# EAGLE design ACME_V4.2 (EAGLE 9.2.1)
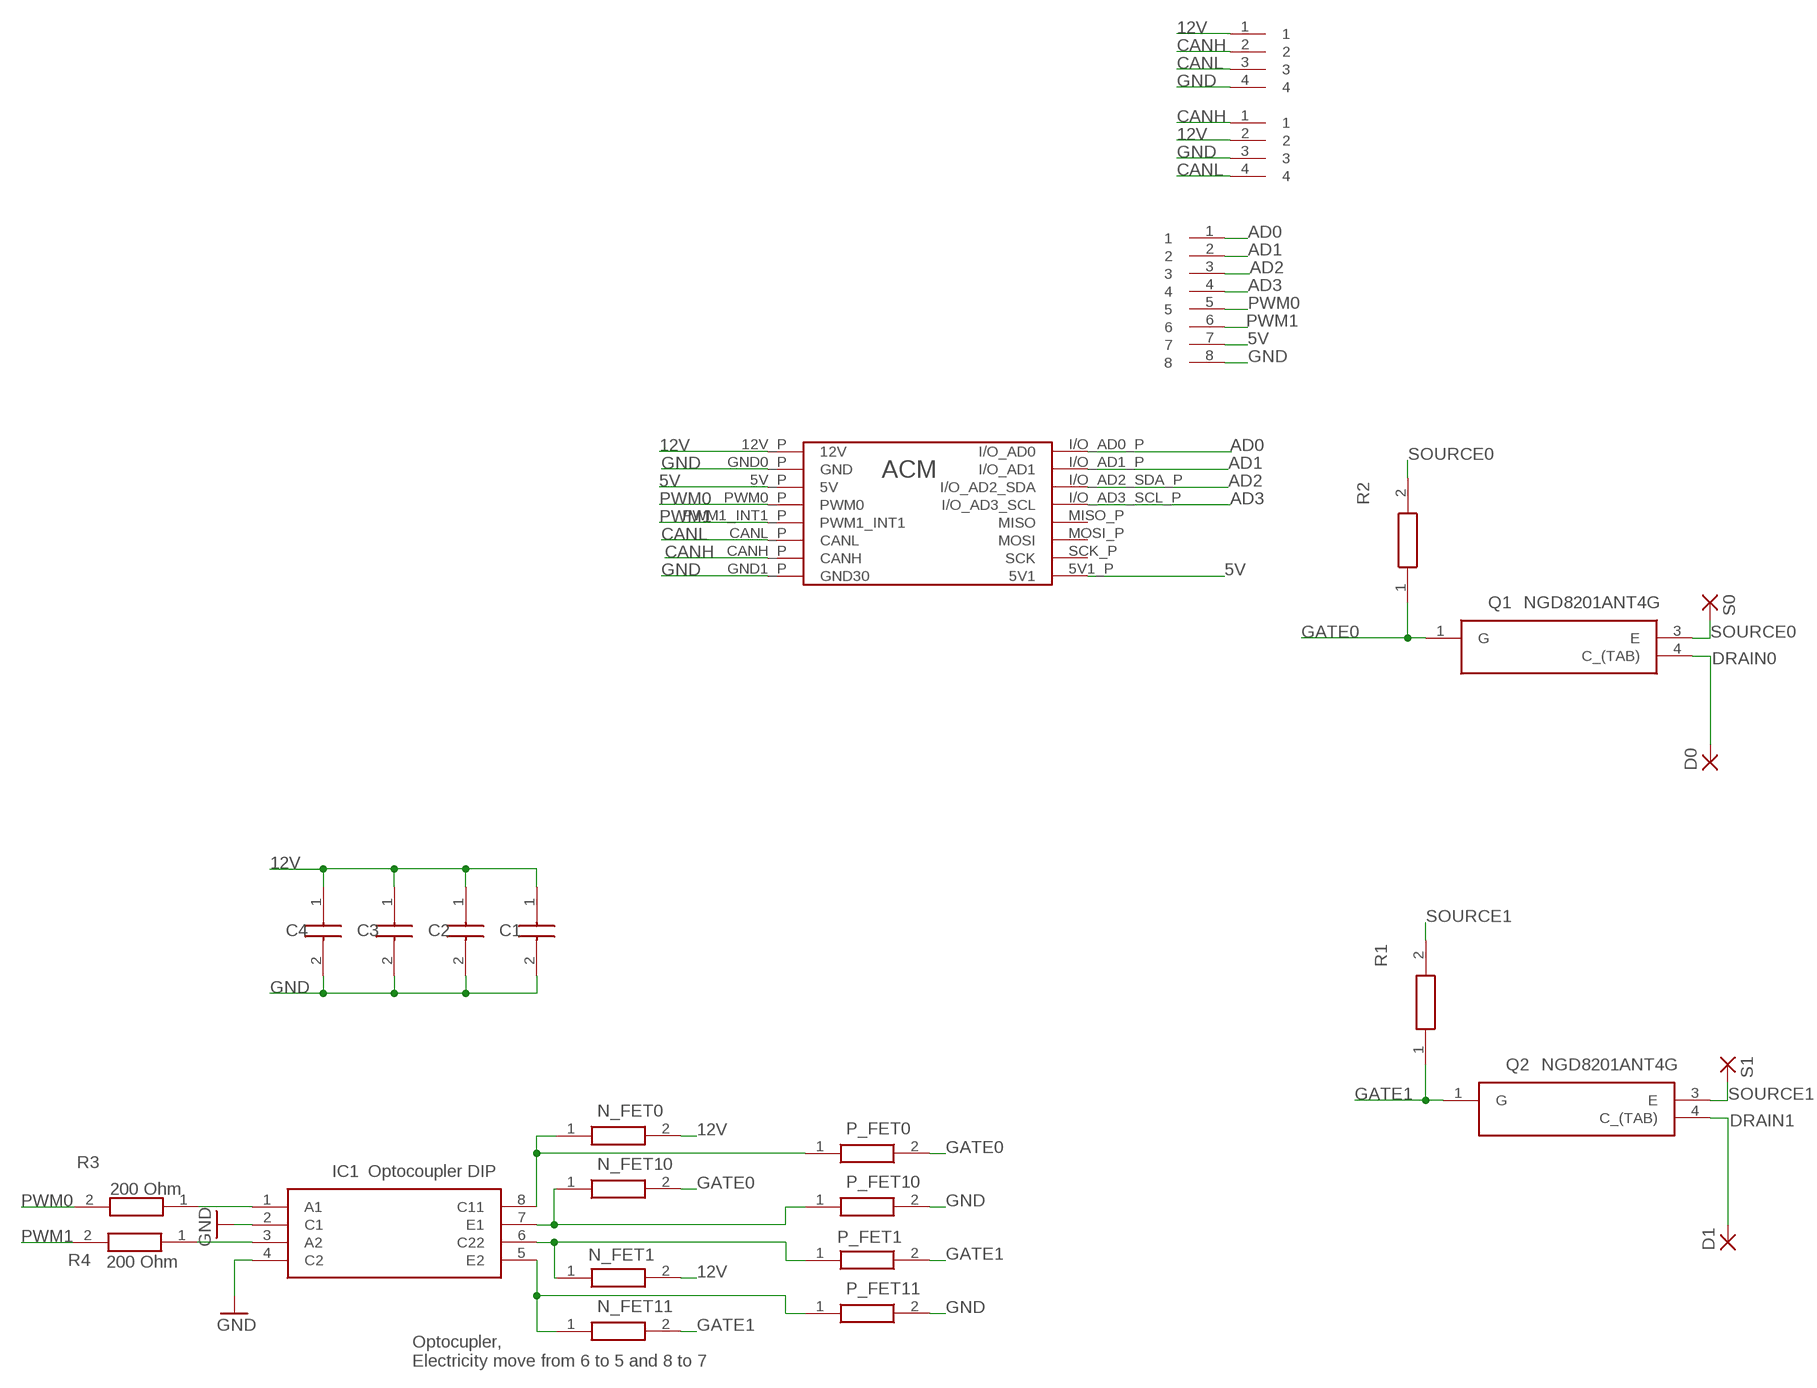
[diagram p0: schematic, sheet 1]

## Parts
C1  TACL105K006XTA  [CAPPC1709X100N]
C2  TACL105K006XTA  [CAPPC1709X100N]
C3  TACL105K006XTA  [CAPPC1709X100N]
C4  TACL105K006XTA  [CAPPC1709X100N]
D0  WIREPADSMD5-2,5  [5-2,5]
D1  WIREPADSMD5-2,5  [5-2,5]
IC1  Optocoupler DIP  TLP350(F)  [DIP762W60P254L966H485Q8N]
N_FET0  ERA-3AEB2262V  [RESC1608X55N]
N_FET1  ERA-3AEB2262V  [RESC1608X55N]
N_FET10  ERA-3AEB2262V  [RESC1608X55N]
N_FET11  ERA-3AEB2262V  [RESC1608X55N]
P_FET0  ERA-3AEB2262V  [RESC1608X55N]
P_FET1  ERA-3AEB2262V  [RESC1608X55N]
P_FET10  ERA-3AEB2262V  [RESC1608X55N]
P_FET11  ERA-3AEB2262V  [RESC1608X55N]
Q1  NGD8201ANT4G  [TO229P990X238-4N]
Q2  NGD8201ANT4G  [TO229P990X238-4N]
R1  ERA-3AEB2262V  [RESC1608X55N]
R2  ERA-3AEB2262V  [RESC1608X55N]
R3  200 Ohm  ERA-3AEB2262V  [RESC1608X55N]
R4  200 Ohm  ERA-3AEB2262V  [RESC1608X55N]
S0  WIREPADSMD5-2,5  [5-2,5]
S1  WIREPADSMD5-2,5  [5-2,5]
U$1  ACM_CASTELLATED  [ACM_CAS_FP]
U$3  16P_CONNECTOR  [16P_CONNECTOR_FP]
U$4  16P_CONNECTOR  [16P_CONNECTOR_FP]
U$5  16P_CONNECTOR  [16P_CONNECTOR_FP]

## Nets
5V: U$1.5V1_P(5V1) U$1.5V_P(5V) U$5.7
12V: C1.1(+) C2.1(+) C3.1(+) C4.1(+) N_FET0.2 N_FET1.2 U$1.12V_P(12V) U$3.1 U$4.2
AD0: U$1.I/O_AD0_P(I/O_AD0) U$5.1
AD1: U$1.I/O_AD1_P(I/O_AD1) U$5.2
AD2: U$1.I/O_AD2_SDA_P(I/O_AD2_SDA) U$5.3
AD3: U$1.I/O_AD3_SCL_P(I/O_AD3_SCL) U$5.4
CANH: U$1.CANH_P(CANH) U$3.2 U$4.1
CANL: U$1.CANL_P(CANL) U$3.3 U$4.4
DRAIN0: D0.1(P) Q1.4(C_(TAB))
DRAIN1: D1.1(P) Q2.4(C_(TAB))
GATE0: N_FET10.2 P_FET0.2 Q1.1(G) R2.1
GATE1: N_FET11.2 P_FET1.2 Q2.1(G) R1.1
GND: C1.2(-) C2.2(-) C3.2(-) C4.2(-) IC1.2(C1) IC1.4(C2) P_FET10.2 P_FET11.2 U$1.GND0_P(GND) U$1.GND1_P(GND30) U$3.4 U$4.3 U$5.8
N$2: IC1.1(A1) R3.1
N$4: IC1.8(C11) N_FET0.1 P_FET0.1
N$5: IC1.6(C22) N_FET1.1 P_FET1.1
N$6: IC1.3(A2) R4.1
N$8: IC1.5(E2) N_FET11.1 P_FET11.1
N$9: IC1.7(E1) N_FET10.1 P_FET10.1
PWM0: R3.2 U$1.PWM0_P(PWM0) U$5.5
PWM1: R4.2 U$1.PWM1_INT1_P(PWM1_INT1) U$5.6
SOURCE0: Q1.3(E) R2.2 S0.1(P)
SOURCE1: Q2.3(E) R1.2 S1.1(P)
Unconnected: U$1.MISO_P(MISO) U$1.MOSI_P(MOSI) U$1.SCK_P(SCK)

## Notes on the sheet
- Optocupler,
  Electricity move from 6 to 5 and 8 to 7

## Library data of the parts
C1-C4 = 0603_Tantalum_Capacitor:TACL105K006XTA: Tantalum Capacitors - Solid SMD 0603 6.3V 1.0uF 10% Source: Datasheet <http://www.mouser.com/ds/2/40/tac-776418.pdf>; DESCRIPTION: Tantalum Capacitors - Solid SMD 0603 6.3V 1.0uF 10%; HEIGHT: 1mm; MANUFACTURER_NAME: AVX; MANUFACTURER_PART_NUMBER: TACL105K006XTA; MOUSER_PART_NUMBER: 581-TACL105K006X; MOUSER_PRICE-STOCK: https://www.mouser.com/Search/Refine.aspx?Keyword=581-TACL105K006X
D0 D1 S0 S1 = wirepad:WIREPAD: Wire PAD connect wire on PCB
IC1 = TLP350(F):TLP350(F): Toshiba TLP350(F) DC Input Optocoupler, Through Hole, 8-Pin PDIP Source: Datasheet <https://toshiba.semicon-storage.com/info/docget.jsp?did=6217&prodName=TLP350>; DESCRIPTION: Toshiba TLP350(F) DC Input Optocoupler, Through Hole, 8-Pin PDIP; HEIGHT: 4.85mm; MANUFACTURER_NAME: Toshiba; MANUFACTURER_PART_NUMBER: TLP350(F); MOUSER_PART_NUMBER: 757-TLP350(F); MOUSER_PRICE-STOCK: https://www.mouser.com/Search/Refine.aspx?Keyword=757-TLP350%28F%29; RS_PART_NUMBER: 0186022P; RS_PRICE-STOCK: http://uk.rs-online.com/web/p/products/0186022P
N_FET0 N_FET1 N_FET10 N_FET11 P_FET0 P_FET1 P_FET10 P_FET11 R1-R4 = ERA-3AEB2262V(0603 Resistor):ERA-3AEB2262V: Thin Film Resistors - SMD 0603 22.6Kohm 0.1% 25ppm Source: Datasheet <https://industrial.panasonic.com/cdbs/www-data/pdf/RDA0000/AOA0000C237.pdf>; DESCRIPTION: Thin Film Resistors - SMD 0603 22.6Kohm 0.1% 25ppm; HEIGHT: 0.55mm; MANUFACTURER_NAME: Panasonic; MANUFACTURER_PART_NUMBER: ERA-3AEB2262V; MOUSER_PART_NUMBER: 667-ERA-3AEB2262V; MOUSER_PRICE-STOCK: https://www.mouser.com/Search/Refine.aspx?Keyword=667-ERA-3AEB2262V
Q1 Q2 = NGD8201ANT4G_Mosfet:NGD8201ANT4G: Source: Datasheet <http://www.onsemi.com/pub/Collateral/NGD8201N-D.PDF>; ALLIED_NUMBER: 70341208; ALLIED_PRICE-STOCK: http://www.alliedelec.com/on-semiconductor-ngd8201ant4g/70341208/; HEIGHT: 2.38mm; MANUFACTURER_NAME: ON Semiconductor; MANUFACTURER_PART_NUMBER: NGD8201ANT4G; MOUSER_PART_NUMBER: 7470901; MOUSER_PRICE-STOCK: http://uk.rs-online.com/web/p/products/7470901; RS_PART_NUMBER: 7470901; RS_PRICE-STOCK: http://uk.rs-online.com/web/p/products/7470901
U$1 = ACM_Pindown:ACM_CASTELLATED
U$3 U$4 = 4P_Connector holes:16P_CONNECTOR
U$5 = 8P_Connector holes_Screwterminal:16P_CONNECTOR

## Board
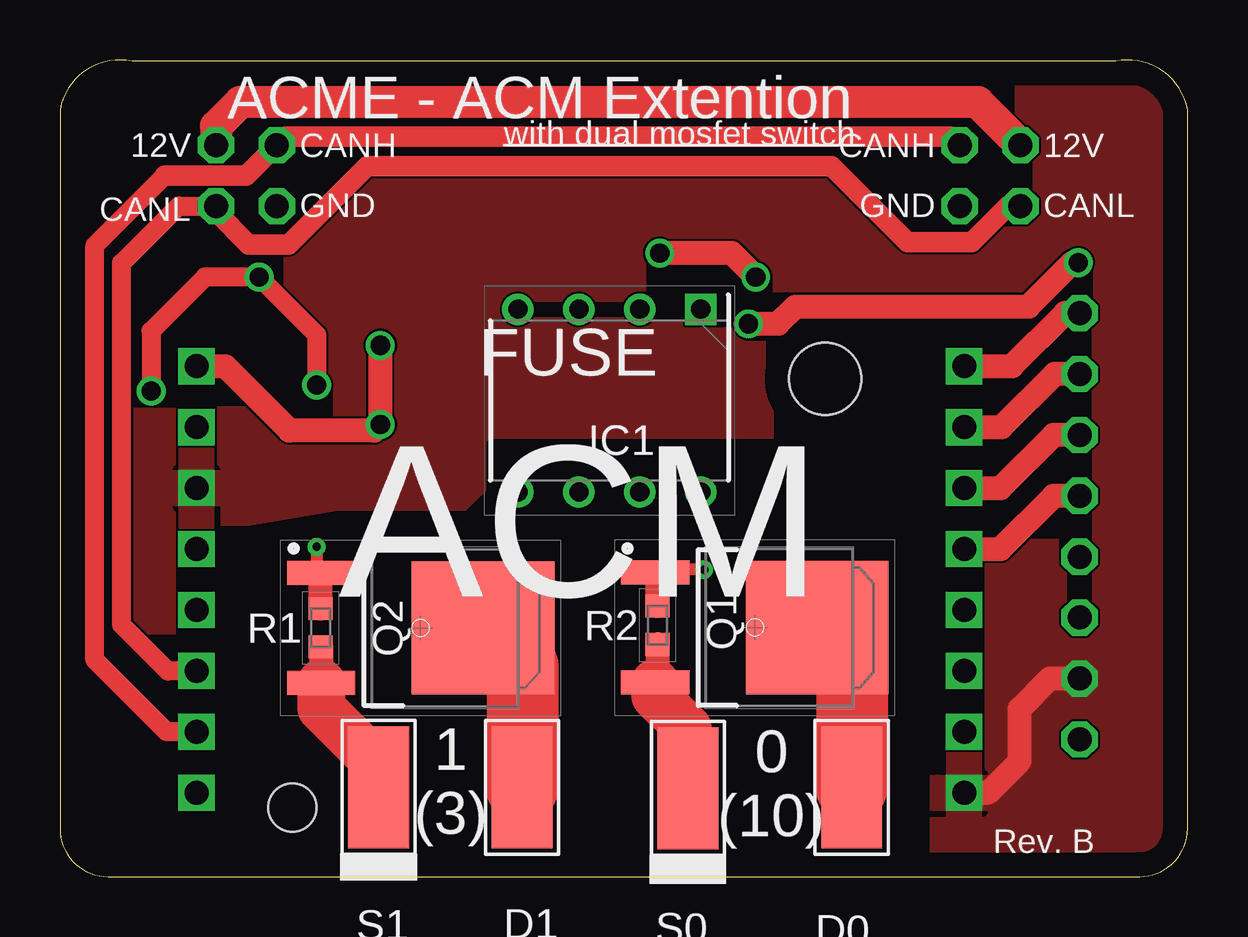
[diagram p1: board, top side]
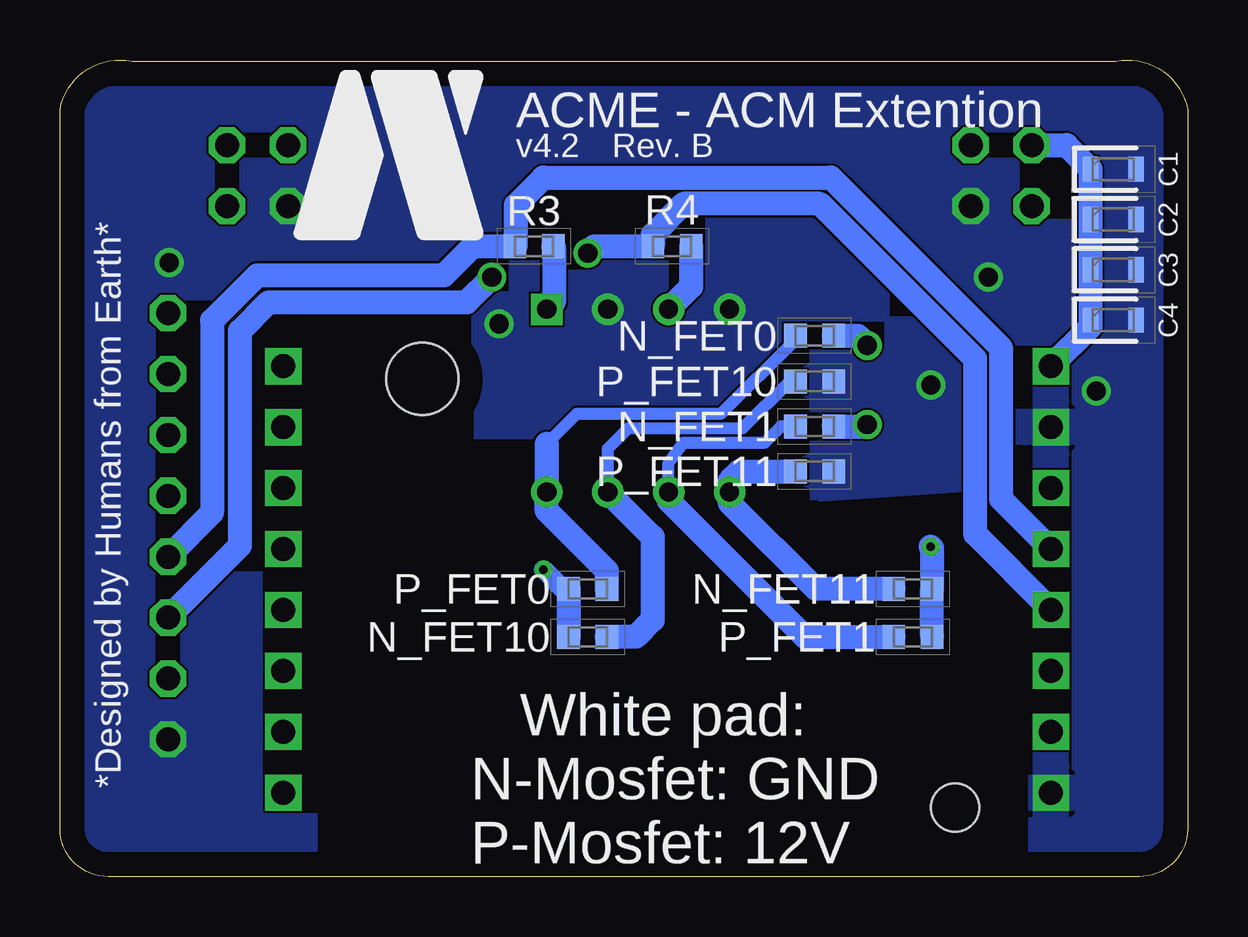
[diagram p2: board, bottom side, seen from below]

Size 47 x 34.05 mm. Coordinates in mm from the lower left corner, seen from the top.
Outline: 2,0 45,0 arc90 47,2 47,32 arc90 44,34 3,34 arc90 0,32 0,2 arc90 2,0
Copper layers (1*16): Top 0.035mm / dielectric 1.53mm / Bottom 0.035mm
Design rules "default *": minimum track width 3.5mil, minimum drill 0.2mm, track to track 3.5mil, track to pad 3.5mil, pad to pad 5mil, via to via 5mil, smd to smd 3.5mil, copper to edge 40mil, drill to drill 6mil, minimum pad ring 10mil, minimum via ring 8mil, stop-mask expansion 4mil, vias tented up to drill 0mil, thermal gap 10mil
Holes 2 mm at 9.69,2.89
Holes 3 mm at 31.9,20.75

### Footprints (pad centres in the part's own frame; a part is rotated, then mirrored left to right if it is on the bottom)
CAPPC1709X100N = smd 0.65 x 1.05: 1 -0.95,0; 2 0.95,0
5-2,5 = smd 2.54 x 5.08: 1 0,0
DIP762W60P254L966H485Q8N = drill 0.8 pad 1.2 square: 1 -3.81,3.81 | drill 0.8 pad 1.2: 2 -3.81,1.27; 3 -3.81,-1.27; 4 -3.81,-3.81; 5 3.81,-3.81; 6 3.81,-1.27; 7 3.81,1.27; 8 3.81,3.81
RESC1608X55N = smd 0.95 x 1: 1 -0.8,0; 2 0.8,0
TO229P990X238-4N = smd 2.85 x 1: 1 -4.15,2.29; 3 -4.15,-2.29 | smd 5.95 x 5.55: 4 2.6,0
ACM_CAS_FP = drill 1 square: 5V1_P 32,3.61; 5V_P 0,16.31; 12V_P 0,21.39; CANH_P 0,6.15; CANL_P 0,8.69; GND0_P 0,18.85; GND1_P 0,3.61; I/O_AD0_P 32,21.39; I/O_AD1_P 32,18.85; I/O_AD2_SDA_P 32,16.31; I/O_AD3_SCL_P 32,13.77; MISO_P 32,11.23; MOSI_P 32,8.69; PWM0_P 0,13.77; PWM1_INT1_P 0,11.23; SCK_P 32,6.15
16P_CONNECTOR_FP = drill 1 octagon: 1 0,0; 2 2.54,0; 3 0,-2.54; 4 2.54,-2.54
16P_CONNECTOR_FP' = drill 1 octagon: 1 0,0; 2 2.54,0; 3 5.08,0; 4 7.62,0; 5 10.16,0; 6 12.7,0; 7 15.24,0; 8 17.78,0

### Placement (x,y rotation side)
C1  3.1,29.5 0 bottom
C2  3.1,27.4 0 bottom
C3  3.1,25.3 0 bottom
C4  3.1,23.2 0 bottom
D0  33,3.73 180 top
D1  19.26,3.73 180 top
IC1  22.9,19.85 270 top
N_FET0  15.55,22.55 0 bottom
N_FET1  15.55,18.77 0 bottom
N_FET10  25,10 180 bottom
N_FET11  11.45,12 0 bottom
P_FET0  25,12 180 bottom
P_FET1  11.45,10 0 bottom
P_FET10  15.55,20.65 0 bottom
P_FET11  15.55,16.9 0 bottom
Q1  28.96,10.39 0 top
Q2  15.04,10.38 0 top
R1  10.86,10.38 270 top
R2  24.91,10.49 270 top
R3  27.24,26.28 180 bottom
R4  21.49,26.28 180 bottom
S0  26.17,3.68 0 top
S1  13.28,3.73 180 top
U$1  5.69,-0.11 0 top
U$3  6.5,30.5 0 top
U$4  37.5,30.5 0 top
U$5  16P_CONNECTOR  [16P_CONNECTOR_FP']  42.5,23.5 270 top

### Tracks (layer width: path | path; a pad name or v marks a point on that pad's centre or on a via)
5V
  Top 1: U$5.7 41.26,8.26 40,7 40,4.81 38.69,3.5 U$1.5V1_P
  pour Top: 60,42 60,2 50,-8 -5,-8 -9,-4 -9,32 1,42
  cutout Top: 37,-2 36,-1 36,18 18,18 18,16 17,15 11.54,15 6.78,14.18 6.78,-2
12V  (via drill 0.8)
  Top 1: v13.35,22.15 v13.35,18.85 13.1,18.6 9.57,18.6 6.89,21.28 U$1.12V_P
  Top 1.33: U$3.1 6.5,31.29 7.51,32.3 38.27,32.3 40.04,30.52 U$4.2
  Bottom 1: N_FET1.2 13.43,18.77 v13.35,18.85 | N_FET0.2 13.75,22.55 v13.35,22.15 | U$3.1 5.05,30.5 C1.1 C2.1 C3.1 C4.1 4.05,22.92 U$1.12V_P
AD0
  Top 1: U$5.1 41.9,23.5 39.68,21.28 U$1.I/O_AD0_P
AD1
  Top 1: U$5.2 41.46,20.96 39.24,18.74 U$1.I/O_AD1_P
AD2
  Top 1: U$5.3 41.42,18.42 39.2,16.2 U$1.I/O_AD2_SDA_P
AD3
  Top 1: U$5.4 41.42,15.88 39.2,13.66 U$1.I/O_AD3_SCL_P
CANH
  Top 0.8: 4.37,29.23 1.45,26.32 1.45,9.03 4.45,6.04 U$1.CANH_P
  Top 0.85: U$4.1 37.14,30.86 9.4,30.86 U$3.2 7.77,29.23 4.37,29.23
CANL
  Top 0.8: U$3.3 4.95,27.96 2.57,25.58 2.57,10.5 4.49,8.58 U$1.CANL_P
  Top 0.85: U$3.3 6.5,27.73 7.87,26.36 9.54,26.36 12.81,29.63 32.15,29.63 35.33,26.45 38,26.45 39.51,27.96 U$4.4
DRAIN0
  Top 3: D0.1 33.01,8.94 Q1.4
DRAIN1
  Top 3: D1.1 19.29,3.76 19.29,8.73 Q2.4
GATE0  (via drill 0.35)
  Top 0.5: v26.85,12.8 24.93,12.8 Q1.1
  Top 1: R2.1 24.91,12.58 Q1.1
  Bottom 0.8: v26.85,12.8 25.8,11.75 N_FET10.2
  Bottom 1: P_FET0.2 N_FET10.2
GATE1  (via drill 0.35)
  Top 0.5: v10.7,13.75 10.7,12.85 Q2.1
  Top 1: Q2.1 10.86,12.64 R1.1
  Bottom 1: P_FET1.2 N_FET11.2 10.65,13.7 v10.7,13.75
GND  (via drill 0.8)
  Top 0.8: v3.8,20.25 3.8,22.75 6.05,25 v8.3,25 10.7,22.6 v10.7,20.5
  Top 1: v42.45,25.6 42.2,25.6 40.37,23.77 30.65,23.77 29.93,23.05 v28.7,23.05
  pour Bottom: 54,40 54,-11 -12,-11 -12,40
  cutout Bottom: 36,-3 36,18 18,18 18,15.23 8.98,15.83 6.9,13.75 6.9,-3
N$2
  Bottom 1: R3.1 26.41,26.25 26.41,23.96 IC1.1
N$4
  Bottom 0.5: N_FET0.1 16.35,22.4 19.45,19.3 25.45,19.3 26.71,18.04
  Bottom 1: P_FET0.1 24.2,12.75 26.71,15.26 IC1.8 26.71,18.04
N$5
  Bottom 0.5: IC1.6 21.63,17.25 21.02,18.1 17.62,18.1 16.95,18.77 N_FET1.1
  Bottom 1: IC1.6 21.63,15.68 15.95,10 P_FET1.1
N$6
  Bottom 1: R4.1 20.69,24.6 IC1.3
N$8
  Bottom 1: N_FET11.1 15.5,12 19.09,15.59 IC1.5 19.09,16.49 18.68,16.9 P_FET11.1
N$9
  Bottom 0.5: P_FET10.1 16.6,20.65 18.55,18.7 23.31,18.7 24.17,17.84 IC1.7
  Bottom 1: IC1.7 22.3,14.17 22.3,10.7 23,10 N_FET10.1
PWM0
  Bottom 1: U$5.5 40.66,15.18 40.66,23.19 38.77,25.08 30.99,25.08 29.79,26.28 R3.2 28,26.32 28,28 26.85,29.15 14.87,29.15 7.76,22.04 7.76,15.73 U$1.PWM0_P
PWM1  (via drill 0.8)
  Top 1: v29,25 28,26 v25,26
  Bottom 1: U$5.6 39.5,13.8 39.5,22.75 38.3,23.95 30.05,23.95 v29,25 | v25,26 24.72,26.28 R4.2 22.29,26.78 21.01,28.06 15.32,28.06 8.85,21.59 8.85,14.28 U$1.PWM1_INT1_P
SOURCE0
  Top 1: R2.2 24.91,8.2 Q1.3
  Top 2: Q1.3 24.81,7.55 26.17,6.19 S0.1
SOURCE1
  Top 1: R1.2 10.89,9.55 Q2.3
  Top 2: Q2.3 10.89,7.04 13.28,4.65 S1.1

### Text on the board
tNames: ACME - ACM Extention | 12V | with dual mosfet switch | CANH | CANH | 12V | CANL | GND | GND | CANL | 1 / (3) | 0 / (10) | Rev. B
bNames: ACME - ACM Extention | Rev. B | v4.2 | *Designed by Humans from Earth* | White pad: / N-Mosfet: GND / P-Mosfet: 12V